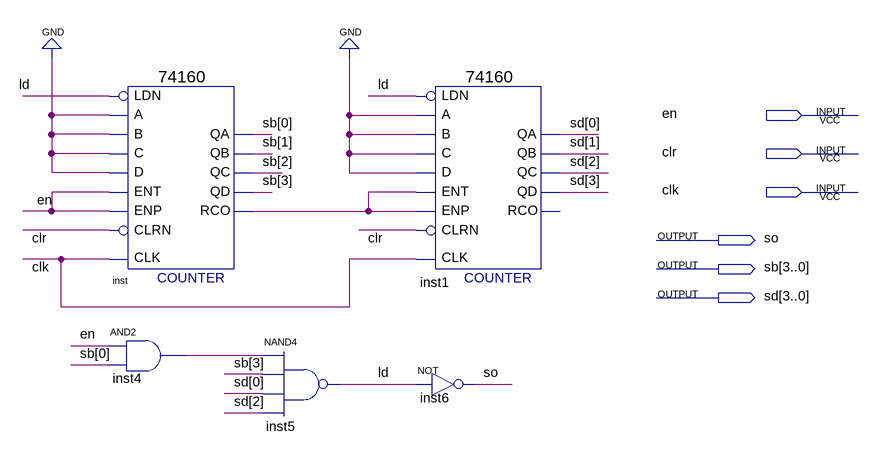
[diagram p0: schematic sheet]
// Quartus schematic mode60.bdf as structural Verilog: 5 symbols, 6 pins
module mode60 (
  input  en,
  input  clr,
  input  clk,
  output so,
  output [3:0] sb,
  output [3:0] sd
);

  wire inst4_out, inst_rco, ld;

  \74160  inst (
    .CLK(clk), .ENT(en), .A(1'b0), .B(1'b0), .C(1'b0), .D(1'b0), .LDN(ld), .ENP(en), .CLRN(clr), .QD(sb[3]),
    .QA(sb[0]), .QB(sb[1]), .QC(sb[2]), .RCO(inst_rco));
  and inst4 (inst4_out, en, sb[0]);
  nand inst5 (ld, inst4_out, sb[3], sd[0], sd[2]);
  \74160  inst1 (
    .CLK(clk), .ENT(inst_rco), .A(1'b0), .B(1'b0), .C(1'b0), .D(1'b0), .LDN(ld), .ENP(inst_rco), .CLRN(clr),
    .QD(sd[3]), .QA(sd[0]), .QB(sd[1]), .QC(sd[2]));  // open: RCO
  not inst6 (so, ld);
endmodule
